# EAGLE design PowerPins (EAGLE 6.2)
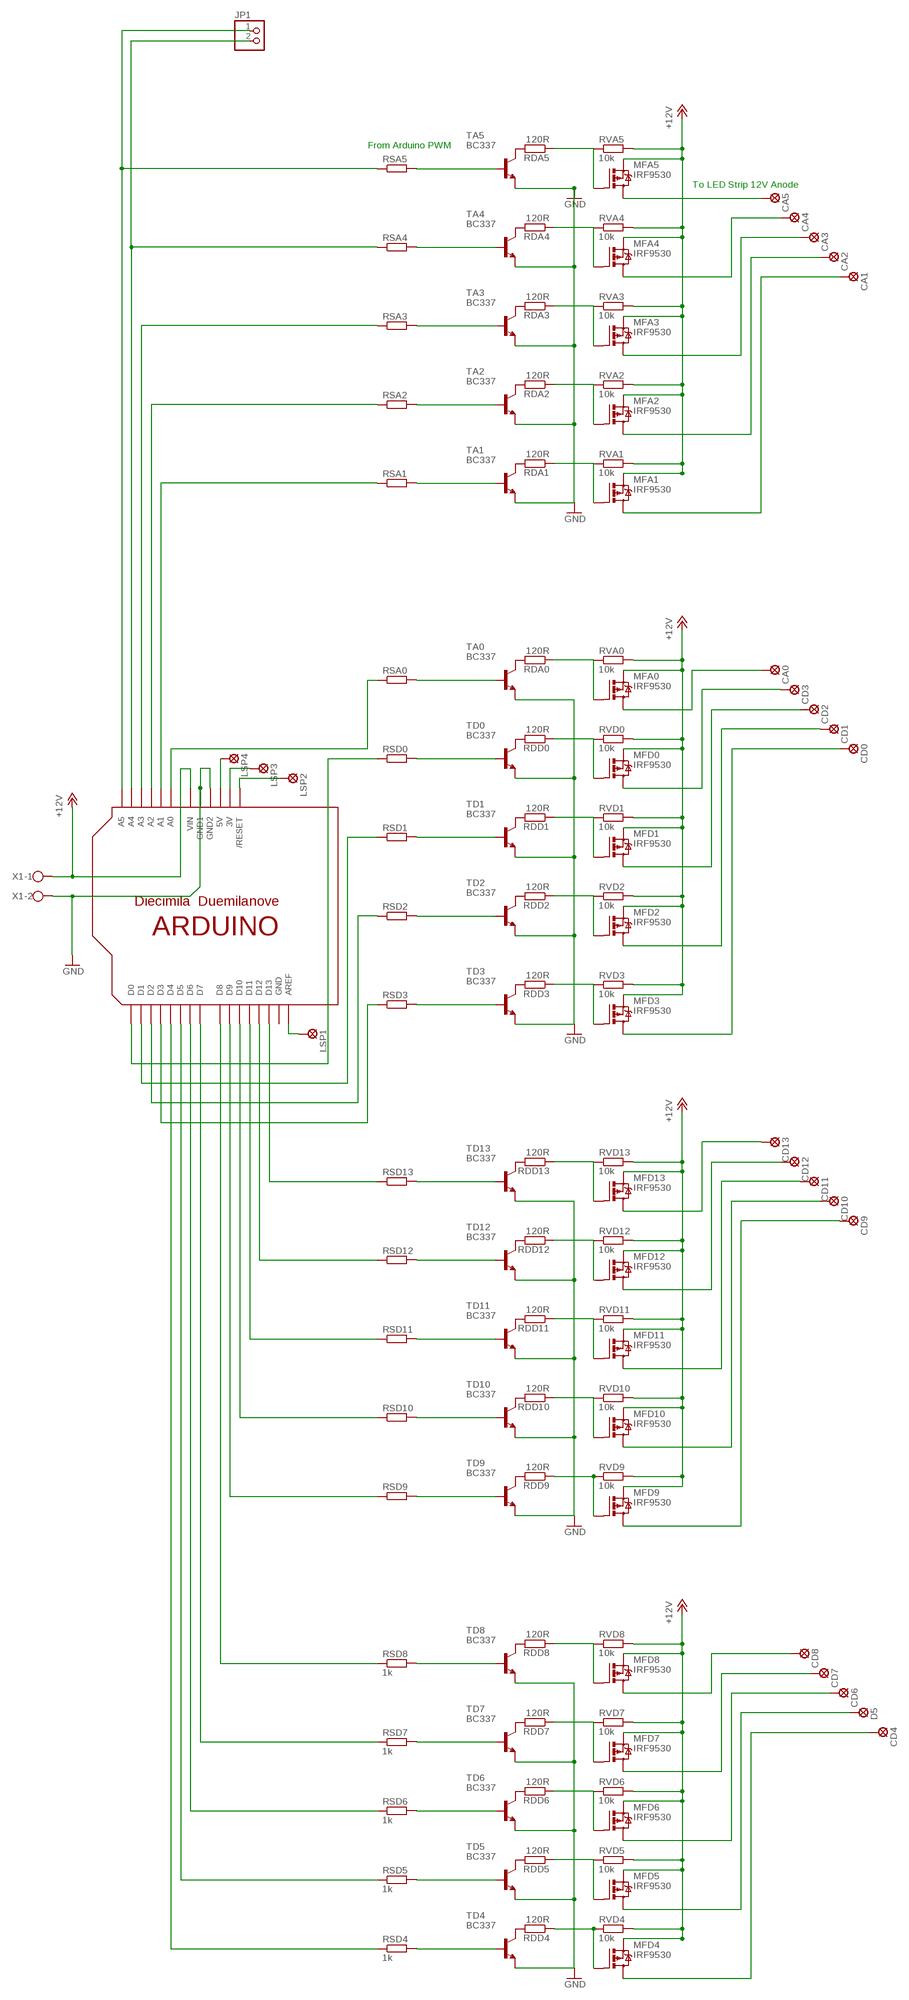
[diagram p0: schematic, sheet 1]

## Parts
CA0  SE14  [SE14]
CA1  SE14  [SE14]
CA2  SE14  [SE14]
CA3  SE14  [SE14]
CA4  SE14  [SE14]
CA5  SE14  [SE14]
CD0  SE14  [SE14]
CD1  SE14  [SE14]
CD2  SE14  [SE14]
CD3  SE14  [SE14]
CD4  SE14  [SE14]
CD6  SE14  [SE14]
CD7  SE14  [SE14]
CD8  SE14  [SE14]
CD9  SE14  [SE14]
CD10  SE14  [SE14]
CD11  SE14  [SE14]
CD12  SE14  [SE14]
CD13  SE14  [SE14]
D5  SE14  [SE14]
JP1  PINHD-1X2  [1X02]
LSP1  MCS10B  [MCS10B]
LSP2  MCS10B  [MCS10B]
LSP3  MCS10B  [MCS10B]
LSP4  MCS10B  [MCS10B]
MFA0  IRF9530  [TO220BV]
MFA1  IRF9530  [TO220BV]
MFA2  IRF9530  [TO220BV]
MFA3  IRF9530  [TO220BV]
MFA4  IRF9530  [TO220BV]
MFA5  IRF9530  [TO220BV]
MFD0  IRF9530  [TO220BV]
MFD1  IRF9530  [TO220BV]
MFD2  IRF9530  [TO220BV]
MFD3  IRF9530  [TO220BV]
MFD4  IRF9530  [TO220BV]
MFD5  IRF9530  [TO220BV]
MFD6  IRF9530  [TO220BV]
MFD7  IRF9530  [TO220BV]
MFD8  IRF9530  [TO220BV]
MFD9  IRF9530  [TO220BV]
MFD10  IRF9530  [TO220BV]
MFD11  IRF9530  [TO220BV]
MFD12  IRF9530  [TO220BV]
MFD13  IRF9530  [TO220BV]
RDA0  120R  R-EU_0204/5  [0204/5]
RDA1  120R  R-EU_0204/5  [0204/5]
RDA2  120R  R-EU_0204/5  [0204/5]
RDA3  120R  R-EU_0204/5  [0204/5]
RDA4  120R  R-EU_0204/5  [0204/5]
RDA5  120R  R-EU_0204/5  [0204/5]
RDD0  120R  R-EU_0204/5  [0204/5]
RDD1  120R  R-EU_0204/5  [0204/5]
RDD2  120R  R-EU_0204/5  [0204/5]
RDD3  120R  R-EU_0204/5  [0204/5]
RDD4  120R  R-EU_0204/5  [0204/5]
RDD5  120R  R-EU_0204/5  [0204/5]
RDD6  120R  R-EU_0204/5  [0204/5]
RDD7  120R  R-EU_0204/5  [0204/5]
RDD8  120R  R-EU_0204/5  [0204/5]
RDD9  120R  R-EU_0204/5  [0204/5]
RDD10  120R  R-EU_0204/5  [0204/5]
RDD11  120R  R-EU_0204/5  [0204/5]
RDD12  120R  R-EU_0204/5  [0204/5]
RDD13  120R  R-EU_0204/5  [0204/5]
RSA0  R-EU_0204/5  [0204/5]
RSA1  R-EU_0204/5  [0204/5]
RSA2  R-EU_0204/5  [0204/5]
RSA3  R-EU_0204/5  [0204/5]
RSA4  R-EU_0204/5  [0204/5]
RSA5  R-EU_0204/5  [0204/5]
RSD0  R-EU_0204/5  [0204/5]
RSD1  R-EU_0204/5  [0204/5]
RSD2  R-EU_0204/5  [0204/5]
RSD3  R-EU_0204/5  [0204/5]
RSD4  1k  R-EU_0204/5  [0204/5]
RSD5  1k  R-EU_0204/5  [0204/5]
RSD6  1k  R-EU_0204/5  [0204/5]
RSD7  1k  R-EU_0204/5  [0204/5]
RSD8  1k  R-EU_0204/5  [0204/5]
RSD9  R-EU_0204/5  [0204/5]
RSD10  R-EU_0204/5  [0204/5]
RSD11  R-EU_0204/5  [0204/5]
RSD12  R-EU_0204/5  [0204/5]
RSD13  R-EU_0204/5  [0204/5]
RVA0  10k  R-EU_0204/5  [0204/5]
RVA1  10k  R-EU_0204/5  [0204/5]
RVA2  10k  R-EU_0204/5  [0204/5]
RVA3  10k  R-EU_0204/5  [0204/5]
RVA4  10k  R-EU_0204/5  [0204/5]
RVA5  10k  R-EU_0204/5  [0204/5]
RVD0  10k  R-EU_0204/5  [0204/5]
RVD1  10k  R-EU_0204/5  [0204/5]
RVD2  10k  R-EU_0204/5  [0204/5]
RVD3  10k  R-EU_0204/5  [0204/5]
RVD4  10k  R-EU_0204/5  [0204/5]
RVD5  10k  R-EU_0204/5  [0204/5]
RVD6  10k  R-EU_0204/5  [0204/5]
RVD7  10k  R-EU_0204/5  [0204/5]
RVD8  10k  R-EU_0204/5  [0204/5]
RVD9  10k  R-EU_0204/5  [0204/5]
RVD10  10k  R-EU_0204/5  [0204/5]
RVD11  10k  R-EU_0204/5  [0204/5]
RVD12  10k  R-EU_0204/5  [0204/5]
RVD13  10k  R-EU_0204/5  [0204/5]
TA0  BC337  [TO92]
TA1  BC337  [TO92]
TA2  BC337  [TO92]
TA3  BC337  [TO92]
TA4  BC337  [TO92]
TA5  BC337  [TO92]
TD0  BC337  [TO92]
TD1  BC337  [TO92]
TD2  BC337  [TO92]
TD3  BC337  [TO92]
TD4  BC337  [TO92]
TD5  BC337  [TO92]
TD6  BC337  [TO92]
TD7  BC337  [TO92]
TD8  BC337  [TO92]
TD9  BC337  [TO92]
TD10  BC337  [TO92]
TD11  BC337  [TO92]
TD12  BC337  [TO92]
TD13  BC337  [TO92]
U$1  ARDUINOUNO  [ARDUINO]
X1  W237-102  [W237-102]

## Nets
+12V: MFA0.S MFA1.S MFA2.S MFA3.S MFA4.S MFA5.S MFD0.S MFD1.S MFD2.S MFD3.S MFD4.S MFD5.S MFD6.S MFD7.S MFD8.S MFD9.S MFD10.S MFD11.S MFD12.S MFD13.S RVA0.2 RVA1.2 RVA2.2 RVA3.2 RVA4.2 RVA5.2 RVD0.2 RVD1.2 RVD2.2 RVD3.2 RVD4.2 RVD5.2 RVD6.2 RVD7.2 RVD8.2 RVD9.2 RVD10.2 RVD11.2 RVD12.2 RVD13.2 U$1.VIN X1.1
C9V: RSA0.1 U$1.A0
CD12: CD11.MP MFD11.D
CD13: CD12.MP MFD12.D
GND: TA0.1(E) TA1.1(E) TA2.1(E) TA3.1(E) TA4.1(E) TA5.1(E) TD0.1(E) TD1.1(E) TD2.1(E) TD3.1(E) TD4.1(E) TD5.1(E) TD6.1(E) TD7.1(E) TD8.1(E) TD9.1(E) TD10.1(E) TD11.1(E) TD12.1(E) TD13.1(E) U$1.GND1 U$1.GND2 X1.2
MFD9: CD9.MP MFD9.D
MFDA3: CA3.MP MFA3.D
N$1: RDA5.2 TA5.3(C)
N$2: RSA5.2 TA5.2(B)
N$3: MFA5.G RDA5.1 RVA5.1
N$4: RDA4.2 TA4.3(C)
N$5: RSA4.2 TA4.2(B)
N$6: RDA0.2 TA0.3(C)
N$7: RSA0.2 TA0.2(B)
N$8: MFA0.G RDA0.1 RVA0.1
N$9: RDD0.2 TD0.3(C)
N$10: RSD0.2 TD0.2(B)
N$11: RDD10.2 TD10.3(C)
N$12: RSD10.2 TD10.2(B)
N$13: MFD10.G RDD10.1 RVD10.1
N$14: RDA1.2 TA1.3(C)
N$15: CA5.MP MFA5.D
N$16: RDD8.2 TD8.3(C)
N$17: RSD8.2 TD8.2(B)
N$18: MFD8.G RDD8.1 RVD8.1
N$19: RDD7.2 TD7.3(C)
N$20: RDD4.2 TD4.3(C)
N$21: LSP4.MP U$1.5V
N$22: RSA1.1 U$1.A1
N$23: RSA2.1 U$1.A2
N$24: RSA3.1 U$1.A3
N$25: JP1.2 RSA4.1 U$1.A4
N$26: JP1.1 RSA5.1 U$1.A5
N$27: CA4.MP MFA4.D
N$28: RSD13.1 U$1.D13
N$29: RSD12.1 U$1.D12
N$30: RSD11.1 U$1.D11
N$31: CA2.MP MFA2.D
N$32: RSD10.1 U$1.D10
N$33: RSD9.1 U$1.D9
N$34: RSD8.1 U$1.D8
N$35: RSD7.1 U$1.D7
N$36: CA1.MP MFA1.D
N$37: RSD6.1 U$1.D6
N$38: CA0.MP MFA0.D
N$39: CD3.MP MFD0.D
N$40: RSD5.1 U$1.D5
N$41: CD2.MP MFD1.D
N$42: CD1.MP MFD2.D
N$43: CD0.MP MFD3.D
N$44: CD13.MP MFD13.D
N$45: RSA1.2 TA1.2(B)
N$46: MFA1.G RDA1.1 RVA1.1
N$47: CD10.MP MFD10.D
N$48: RDD11.2 TD11.3(C)
N$49: CD8.MP MFD8.D
N$50: CD7.MP MFD7.D
N$51: CD6.MP MFD6.D
N$52: LSP3.MP U$1.3V
N$53: D5.MP MFD5.D
N$54: CD4.MP MFD4.D
N$55: RSD4.1 U$1.D4
N$56: RSD3.1 U$1.D3
N$57: RSD2.1 U$1.D2
N$58: LSP2.MP U$1.RESET(/RESET)
N$59: LSP1.MP U$1.AREF
N$60: RSD4.2 TD4.2(B)
N$61: RDD9.2 TD9.3(C)
N$64: RSD11.2 TD11.2(B)
N$66: MFD9.G RDD9.1 RVD9.1
N$67: MFD4.G RDD4.1 RVD4.1
N$68: MFD11.G RDD11.1 RVD11.1
N$69: RDD12.2 TD12.3(C)
N$70: RSD12.2 TD12.2(B)
N$71: MFD12.G RDD12.1 RVD12.1
N$72: RDD13.2 TD13.3(C)
N$73: RSD13.2 TD13.2(B)
N$74: MFD13.G RDD13.1 RVD13.1
N$75: RSD7.2 TD7.2(B)
N$76: MFD7.G RDD7.1 RVD7.1
N$77: RDD6.2 TD6.3(C)
N$78: RSD6.2 TD6.2(B)
N$79: MFD6.G RDD6.1 RVD6.1
N$80: RDD5.2 TD5.3(C)
N$81: RSD5.2 TD5.2(B)
N$82: MFD5.G RDD5.1 RVD5.1
N$83: MFD0.G RDD0.1 RVD0.1
N$84: RDD1.2 TD1.3(C)
N$85: RSD1.2 TD1.2(B)
N$86: MFD1.G RDD1.1 RVD1.1
N$87: RDD2.2 TD2.3(C)
N$88: RSD2.2 TD2.2(B)
N$89: MFD2.G RDD2.1 RVD2.1
N$90: RDD3.2 TD3.3(C)
N$91: RSD3.2 TD3.2(B)
N$92: MFD3.G RDD3.1 RVD3.1
N$93: MFA4.G RDA4.1 RVA4.1
N$94: RDA3.2 TA3.3(C)
N$95: RSA3.2 TA3.2(B)
N$96: MFA3.G RDA3.1 RVA3.1
N$97: RDA2.2 TA2.3(C)
N$98: RSA2.2 TA2.2(B)
N$99: MFA2.G RDA2.1 RVA2.1
OUT0: RSD0.1 U$1.D0
OUT1: RSD1.1 U$1.D1
TD9: RSD9.2 TD9.2(B)

## Notes on the sheet
- From Arduino PWM
- To LED Strip 12V Anode

## Power pins joined to a net without a drawn wire
GND: U$1.GND

## Library data of the parts
CA0 CA1-CA5 CD0 CD1-CD4 CD6-CD13 D5 = solpad:SE14: SOLDER PAD E1553, drill 1,4mm, distributor Buerklin, 07F820
JP1 = pinhead:PINHD-1X2: PIN HEADER
LSP1-LSP4 = solpad:MCS10B: SOLDER PAD MC S1, distributor Buerklin, 15F505
MFA0 MFA1-MFA5 MFD0 MFD1-MFD13 = transistor-power:IRF9530: P-CHANNEL HEXFET POWER-MOS-FET Source: http://www.irf.com/product-info/datasheets/data/irf9530.pdf
RDA0 RDD0 RDD1-RDD9 RDD13 RSD9 RSD13 RVA0 RVD0 RVD1-RVD9 RVD13 = rcl:R-EU_: RESISTOR, European symbol
RDA1-RDA5 RDD10-RDD12 RSA0 RSA1-RSA5 RSD0 RSD1-RSD8 RSD10-RSD12 RVA1-RVA5 RVD10-RVD12 = resistor:R-EU_: RESISTOR, European symbol
TA0 TA1-TA5 TD0 TD1-TD13 = transistor:BC337: NPN TRANSISTOR
U$1 = adafruit:ARDUINO: Arduino Diecimila/Duemilanove Make a shield with ease, this package has all the named pins as well as the two mounting drill holes and an outline of the USB and DC power connector. The outline is on the DIMENSION layer, so if your board house uses it they will cut the outline to match. http://www.ladyada.net/library/pcb/eaglelibrary.html
X1 = con-wago-500:W237-102: WAGO SCREW CLAMP; MPN: 237-102; OC_FARNELL: unknown; OC_NEWARK: 70K9898

## Board
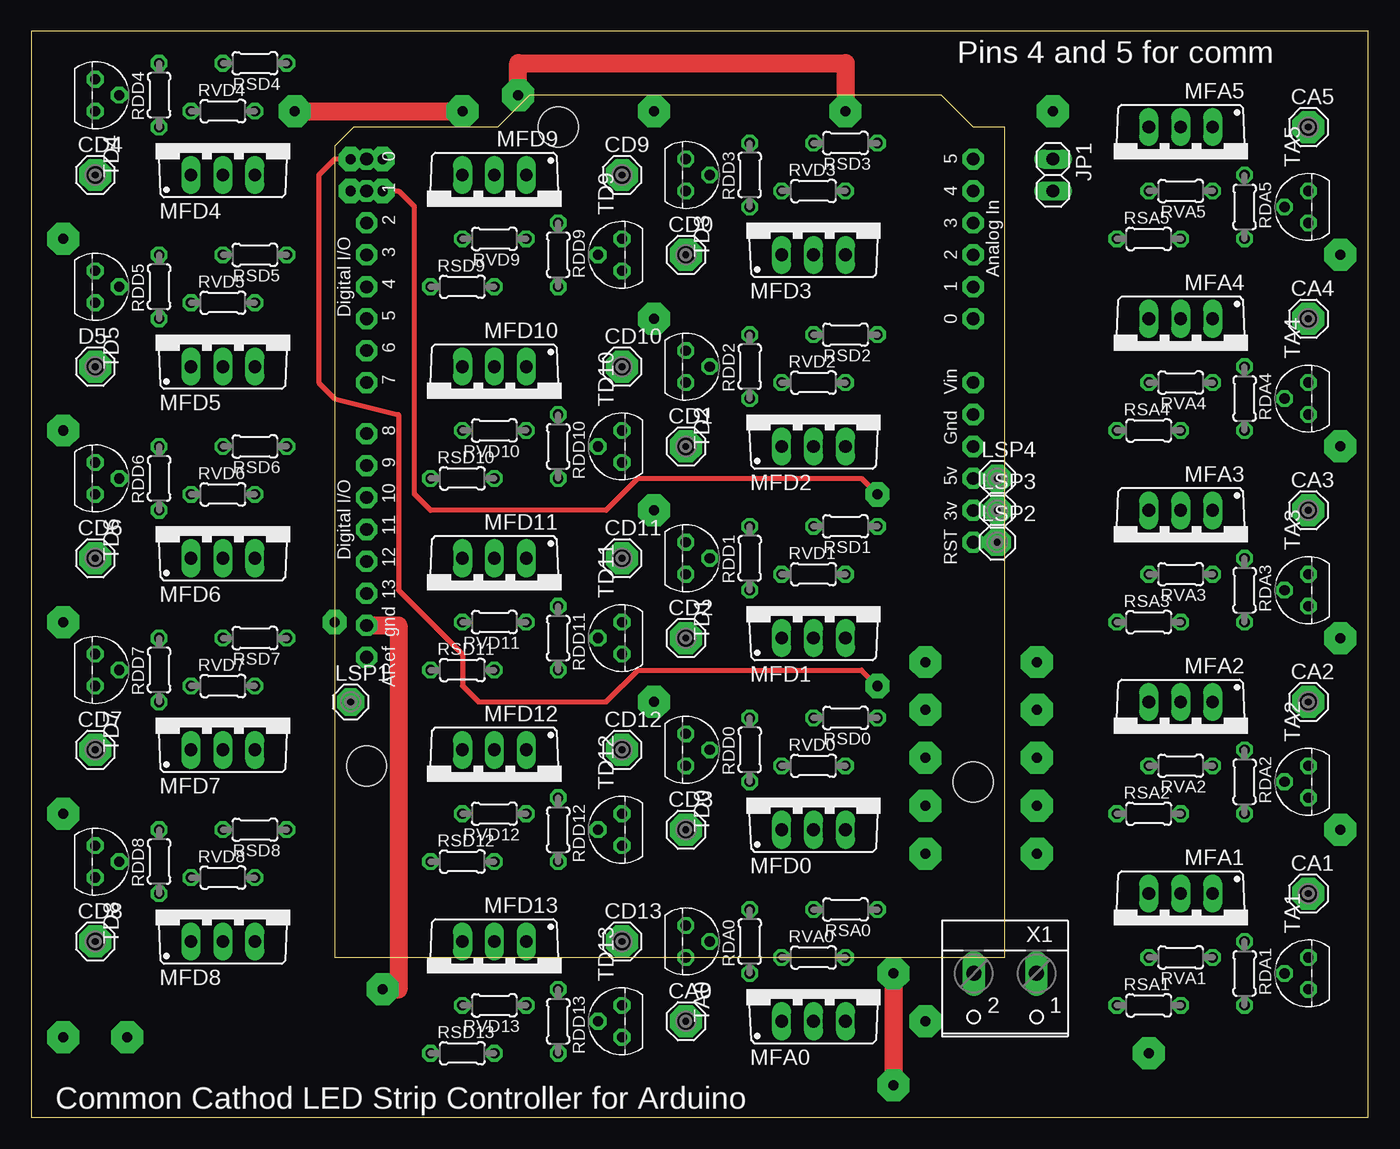
[diagram p1: board, top side]
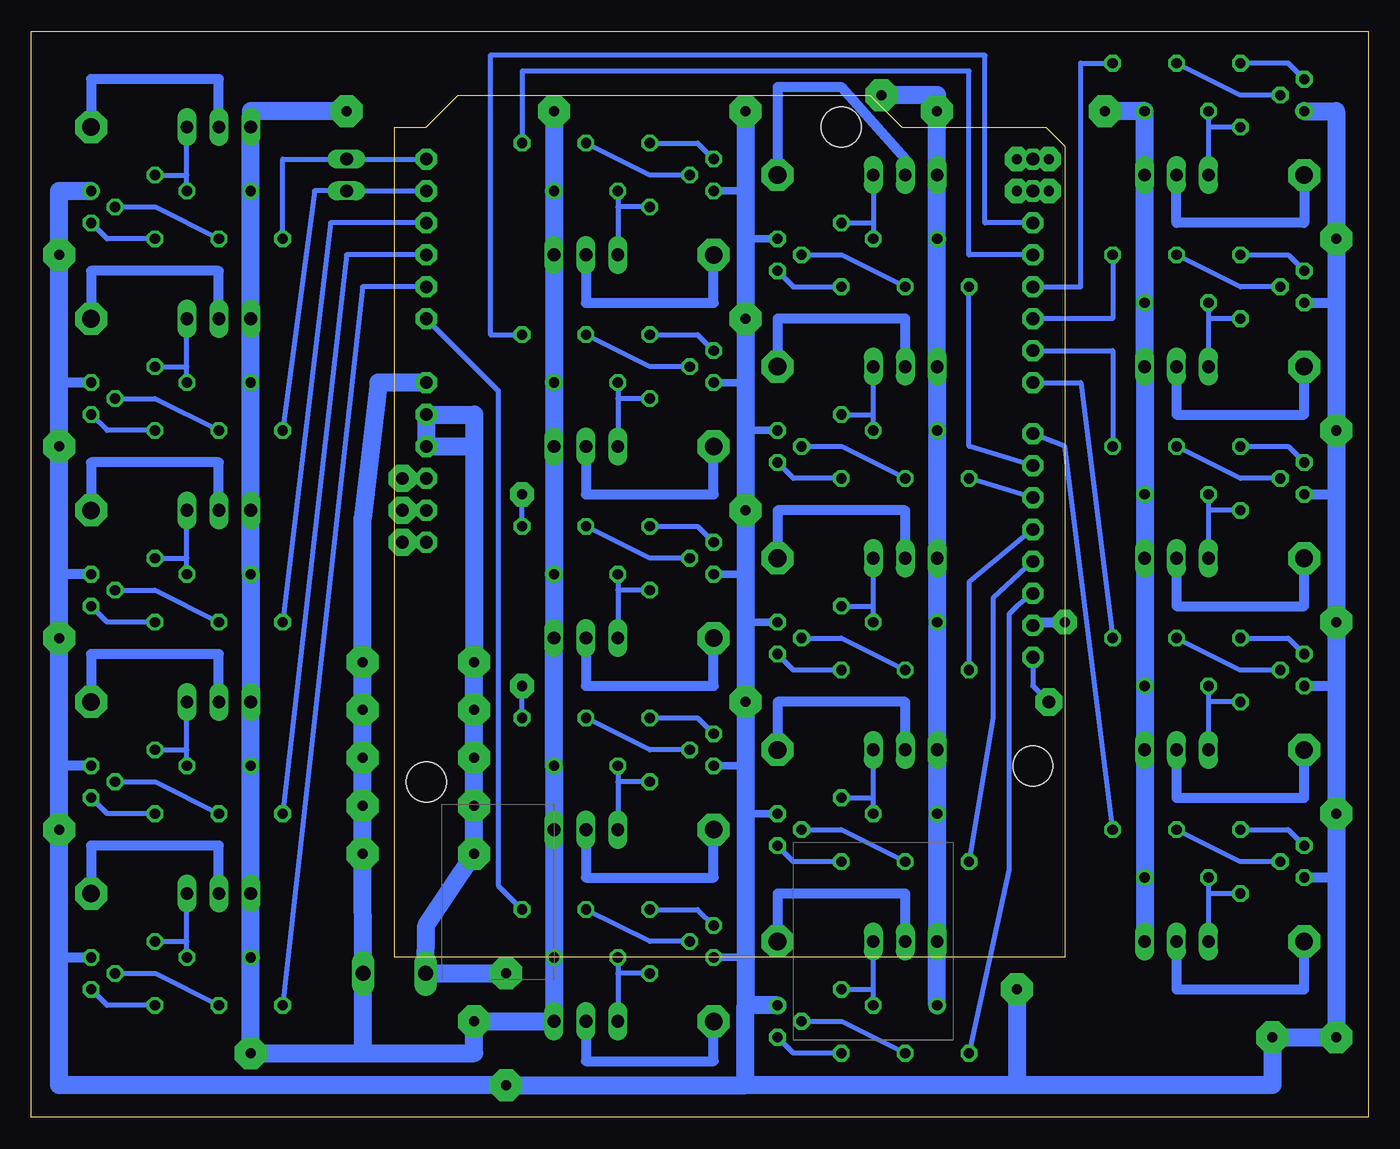
[diagram p2: board, bottom side, seen from below]

Size 106.35 x 86.35 mm. Coordinates in mm from the lower left corner, seen from the top.
Outline: 0,0 106.35,0 106.35,86.35 0,86.35 0,0
Copper layers (1*16): Top 0.035mm / dielectric 1.5mm / Bottom 0.035mm
Design rules: minimum track width 10mil, minimum drill 24mil, track to track 8mil, track to pad 8mil, pad to pad 8mil, via to via 8mil, smd to smd 8mil, copper to edge 0mil, drill to drill 8mil, minimum pad ring 10mil, minimum via ring 8mil, stop-mask expansion 4mil, vias tented up to drill 0mil, thermal gap 10mil

### Footprints (pad centres in the part's own frame; a part is rotated, then mirrored left to right if it is on the bottom)
SE14 = drill 1.397 pad 2.54 octagon: MP 0,0
1X02 = drill 1.016 long: 1 -1.27,0; 2 1.27,0
MCS10B = drill 1.016 pad 2.159 octagon: MP 0,0
TO220BV = drill 1.016 long: D 0,-2.54; G -2.54,-2.54; S 2.54,-2.54
0204/5 = drill 0.813 octagon: 1 -2.54,0; 2 2.54,0
TO92 = drill 0.813 octagon: 1 1.27,0; 2 0,1.905; 3 -1.27,0
ARDUINO = drill 1 pad 1.676 octagon: 3V 35.56,2.54; 5V 38.1,2.54; A0 50.8,2.54; A1 53.34,2.54; A2 55.88,2.54; A3 58.42,2.54; A4 60.96,2.54; A5 63.5,2.54; AREF 23.876,50.8; D0 63.5,50.8; D1 60.96,50.8; D2 58.42,50.8; D3 55.88,50.8; D4 53.34,50.8; D5 50.8,50.8; D6 48.26,50.8; D7 45.72,50.8; D8 41.656,50.8; D9 39.116,50.8; D10 36.576,50.8; D11 34.036,50.8; D12 31.496,50.8; D13 28.956,50.8; GND 26.416,50.8; GND1 43.18,2.54; GND2 40.64,2.54; RESET 33.02,2.54; VIN 45.72,2.54 | hole 3.2: 15.24,50.8; 66.04,35.56; 13.97,2.54
W237-102 = drill 1.194 long: 1 -2.5,-1.27; 2 2.5,-1.27

### Placement (x,y rotation side)
CA0  52.07,7.62 0 top
CA1  101.6,17.78 0 top
CA2  101.6,33.02 0 top
CA3  101.6,48.26 0 top
CA4  101.6,63.5 0 top
CA5  101.6,78.74 0 top
CD0  52.07,68.58 0 top
CD1  52.07,53.34 0 top
CD2  52.07,38.1 0 top
CD3  52.07,22.86 0 top
CD4  5.08,74.93 0 top
CD6  5.08,44.45 0 top
CD7  5.08,29.21 0 top
CD8  5.08,13.97 0 top
CD9  46.99,74.93 0 top
CD10  46.99,59.69 0 top
CD11  46.99,44.45 0 top
CD12  46.99,29.21 0 top
CD13  46.99,13.97 0 top
D5  5.08,59.69 0 top
JP1  81.28,74.93 270 top
LSP1  25.4,33.02 0 top
LSP2  76.83,45.72 0 top
LSP3  76.83,48.26 0 top
LSP4  76.83,50.8 0 top
MFA0  62.23,10.16 0 top
MFA1  91.44,15.24 180 top
MFA2  91.44,30.48 180 top
MFA3  91.44,45.72 180 top
MFA4  91.44,60.96 180 top
MFA5  91.44,76.2 180 top
MFD0  62.23,25.4 0 top
MFD1  62.23,40.64 0 top
MFD2  62.23,55.88 0 top
MFD3  62.23,71.12 0 top
MFD4  15.24,77.47 0 top
MFD5  15.24,62.23 0 top
MFD6  15.24,46.99 0 top
MFD7  15.24,31.75 0 top
MFD8  15.24,16.51 0 top
MFD9  36.83,72.39 180 top
MFD10  36.83,57.15 180 top
MFD11  36.83,41.91 180 top
MFD12  36.83,26.67 180 top
MFD13  36.83,11.43 180 top
RDA0  57.15,13.97 90 top
RDA1  96.52,11.43 270 top
RDA2  96.52,26.67 270 top
RDA3  96.52,41.91 270 top
RDA4  96.52,57.15 270 top
RDA5  96.52,72.39 270 top
RDD0  57.15,29.21 90 top
RDD1  57.15,44.45 90 top
RDD2  57.15,59.69 90 top
RDD3  57.15,74.93 90 top
RDD4  10.16,81.28 90 top
RDD5  10.16,66.04 90 top
RDD6  10.16,50.8 90 top
RDD7  10.16,35.56 90 top
RDD8  10.16,20.32 90 top
RDD9  41.91,68.58 270 top
RDD10  41.91,53.34 270 top
RDD11  41.91,38.1 270 top
RDD12  41.91,22.86 270 top
RDD13  41.91,7.62 270 top
RSA0  64.77,16.51 180 top
RSA1  88.9,8.89 0 top
RSA2  88.9,24.13 0 top
RSA3  88.9,39.37 0 top
RSA4  88.9,54.61 0 top
RSA5  88.9,69.85 0 top
RSD0  64.77,31.75 180 top
RSD1  64.77,46.99 180 top
RSD2  64.77,62.23 180 top
RSD3  64.77,77.47 180 top
RSD4  17.78,83.82 180 top
RSD5  17.78,68.58 180 top
RSD6  17.78,53.34 180 top
RSD7  17.78,38.1 180 top
RSD8  17.78,22.86 180 top
RSD9  34.29,66.04 0 top
RSD10  34.29,50.8 0 top
RSD11  34.29,35.56 0 top
RSD12  34.29,20.32 0 top
RSD13  34.29,5.08 0 top
RVA0  62.23,12.7 0 top
RVA1  91.44,12.7 180 top
RVA2  91.44,27.94 180 top
RVA3  91.44,43.18 180 top
RVA4  91.44,58.42 180 top
RVA5  91.44,73.66 180 top
RVD0  62.23,27.94 0 top
RVD1  62.23,43.18 0 top
RVD2  62.23,58.42 0 top
RVD3  62.23,73.66 0 top
RVD4  15.24,80.01 0 top
RVD5  15.24,64.77 0 top
RVD6  15.24,49.53 0 top
RVD7  15.24,34.29 0 top
RVD8  15.24,19.05 0 top
RVD9  36.83,69.85 180 top
RVD10  36.83,54.61 180 top
RVD11  36.83,39.37 180 top
RVD12  36.83,24.13 180 top
RVD13  36.83,8.89 180 top
TA0  52.07,13.97 270 top
TA1  101.6,11.43 90 top
TA2  101.6,26.67 90 top
TA3  101.6,41.91 90 top
TA4  101.6,57.15 90 top
TA5  101.6,72.39 90 top
TD0  52.07,29.21 270 top
TD1  52.07,44.45 270 top
TD2  52.07,59.69 270 top
TD3  52.07,74.93 270 top
TD4  5.08,81.28 270 top
TD5  5.08,66.04 270 top
TD6  5.08,50.8 270 top
TD7  5.08,35.56 270 top
TD8  5.08,20.32 270 top
TD9  46.99,68.58 90 top
TD10  46.99,53.34 90 top
TD11  46.99,38.1 90 top
TD12  46.99,22.86 90 top
TD13  46.99,7.62 90 top
U$1  77.47,12.7 90 top
X1  77.47,10.16 180 top

### Tracks (layer width: path | path; a pad name or v marks a point on that pad's centre or on a via)
+12V  (via drill 0.8 pad 2.54)
  Top 1.422: v38.73,81.28 38.73,83.82 64.77,83.82 v64.77,80.01 | v20.95,80.01 v34.29,80.01
  Bottom 0.406: MFD6.S RVD6.2 | RVD7.2 MFD7.S | RVD9.2 RVD10.2 | RVD8.2 MFD8.S | RVA2.2 MFA2.S | RVA3.2 MFA3.S | RVA4.2 MFA4.S | RVA5.2 MFA5.S | RVD0.2 MFD0.S | RVA0.2 MFA0.S
  Bottom 1.422: MFD8.S MFD7.S MFD6.S MFD5.S RVD5.2 MFD4.S RVD4.2 v20.95,80.01 | U$1.VIN 78.74,58.42 80.01,47.62 v80.01,36.2 v80.01,32.38 v80.01,28.57 v80.01,24.77 v80.01,20.95 X1.1 80.01,11.43 80.01,5.08 | RVD13.2 MFD13.S RVD12.2 MFD12.S RVD11.2 MFD11.S RVD10.2 MFD10.S RVD9.2 MFD9.S v34.29,80.01 34.29,81.28 v38.73,81.28 | v81.28,80.01 88.9,80.01 MFA5.S MFA4.S RVA3.2 MFA2.S MFA1.S RVA1.2 v88.9,5.08 80.01,5.08 | 80.01,5.08 71.12,5.08 v71.12,7.62 MFA0.S RVD0.2 MFD1.S RVD1.2 MFD2.S RVD2.2 MFD3.S RVD3.2 v64.77,80.01
C9V
  Bottom 0.406: U$1.A0 69.22,57.78 69.22,18.41 RSA0.1
CD12
  Bottom 0.813: MFD11.D 36.83,48.26 46.99,48.26 CD11.MP
CD13
  Bottom 0.813: MFD12.D 36.83,33.02 46.99,33.02 CD12.MP
GND  (via drill 0.8 pad 1.93, 0.8 pad 2.54)
  Top 1.422: v68.58,11.43 v68.58,2.54 | U$1.GND 29.21,39.12 29.21,10.16 v27.94,10.16
  Bottom 0.406: U$1.GND 26.67,39.37
  Bottom 0.61: TD3.1 49.53,73.66 49.53,69.85 | 49.53,69.85 v49.53,63.5 49.53,58.42 | 49.53,58.42 49.53,54.61 | 49.53,54.61 v49.53,48.26 49.53,43.18 | 49.53,43.18 49.53,39.37 | 49.53,39.37 v49.53,33.02 49.53,27.94 | 49.53,27.94 49.53,24.13 | 49.53,24.13 49.53,17.78 49.53,12.7 | 49.53,12.7 49.53,8.89 | TA0.1 49.53,12.7 | TD12.1 49.53,24.13 | TD0.1 49.53,27.94 | TD11.1 49.53,39.37 | TD1.1 49.53,43.18 | TD10.1 49.53,54.61 | TD2.1 49.53,58.42 | TD9.1 49.53,69.85
  Bottom 0.813: v2.54,69.85 2.54,64.77 | 2.54,64.77 v2.54,54.61 2.54,49.53 | 2.54,49.53 v2.54,39.37 2.54,34.29 | 2.54,34.29 v2.54,24.13 2.54,19.05 | 2.54,19.05 TD8.1 | TD5.1 2.54,64.77 | TD6.1 2.54,49.53 | TD7.1 2.54,34.29 | v104.14,68.58 104.14,58.42 | 104.14,58.42 v104.14,53.34 104.14,43.18 | 104.14,43.18 v104.14,38.1 104.14,27.94 | 104.14,27.94 v104.14,22.86 | 104.14,12.7 TA1.1 | TA2.1 104.14,27.94 | TA3.1 104.14,43.18 | TA4.1 104.14,58.42 | 2.54,19.05 v2.54,6.35 | v49.53,80.01 49.53,73.66 v49.53,63.5 | 26.67,39.37 v24.13,39.37
  Bottom 1.422: 71.12,53.34 71.12,55.88 U$1.GND1 U$1.GND2 71.12,53.34 | 71.12,53.34 v71.12,36.2 v71.12,32.38 v71.12,28.57 v71.12,24.77 v71.12,20.95 74.93,15.24 X1.2 v68.58,11.43 | TD4.1 2.54,80.01 v2.54,69.85 v2.54,54.61 v2.54,39.37 v2.54,24.13 v2.54,6.35 v7.62,6.35 7.62,2.54 27.94,2.54 | TA5.1 104.14,73.66 v104.14,68.58 v104.14,53.34 v104.14,38.1 v104.14,22.86 104.14,12.7 104.14,2.54 v68.58,2.54 49.53,2.54 | v49.53,80.01 v49.53,63.5 v49.53,48.26 v49.53,33.02 49.53,17.78 49.53,8.89 | TD13.1 49.53,8.89 | 27.94,2.54 49.53,2.54 | 49.53,2.54 49.53,8.89 | v27.94,10.16 27.94,2.54
MFD9
  Bottom 0.813: MFD9.D 36.83,76.2 41.91,81.92 46.99,81.92 CD9.MP
MFDA3
  Bottom 0.813: MFA3.D 91.44,52.07 101.6,52.07 CA3.MP
N$1
  Bottom 0.406: RDA5.2 100.33,69.85 TA5.3
N$2
  Bottom 0.406: TA5.2 96.52,72.39 RSA5.2
N$3
  Bottom 0.406: RVA5.1 93.98,74.93 | 93.98,74.93 MFA5.G | RDA5.1 93.98,74.93
N$4
  Bottom 0.406: RDA4.2 100.33,54.61 TA4.3
N$5
  Bottom 0.406: TA4.2 96.52,57.15 RSA4.2
N$6
  Bottom 0.406: RDA0.2 53.34,16.51 TA0.3
N$7
  Bottom 0.406: TA0.2 57.15,13.97 RSA0.2
N$8
  Bottom 0.406: RVA0.1 59.69,11.43 | 59.69,11.43 MFA0.G | RDA0.1 59.69,11.43
N$9
  Bottom 0.406: RDD0.2 53.34,31.75 TD0.3
N$10
  Bottom 0.406: TD0.2 57.15,29.21 RSD0.2
N$11
  Bottom 0.406: RDD10.2 45.72,50.8 TD10.3
N$12
  Bottom 0.406: TD10.2 41.91,53.34 RSD10.2
N$13
  Bottom 0.406: RVD10.1 39.37,55.88 | 39.37,55.88 MFD10.G | RDD10.1 39.37,55.88
N$14
  Bottom 0.406: RDA1.2 100.33,8.89 TA1.3
N$15
  Bottom 0.813: MFA5.D 91.44,82.55 101.6,82.55 CA5.MP
N$16
  Bottom 0.406: RDD8.2 6.35,22.86 TD8.3
N$17
  Bottom 0.406: TD8.2 10.16,20.32 RSD8.2
N$18
  Bottom 0.406: RVD8.1 12.7,17.78 | 12.7,17.78 MFD8.G | RDD8.1 12.7,17.78
N$19
  Bottom 0.406: RDD7.2 6.35,38.1 TD7.3
N$20
  Bottom 0.406: TD4.3 6.35,83.82 RDD4.2
N$21
  Bottom 0.406: U$1.5V LSP4.MP
N$22
  Bottom 0.406: U$1.A1 80.01,66.04 RSA1.1
N$23
  Bottom 0.406: U$1.A2 81.28,68.58 RSA2.1
N$24
  Bottom 0.406: U$1.A3 82.55,71.12 RSA3.1
N$25
  Bottom 0.406: U$1.A4 JP1.2 83.82,73.66 RSA4.1
N$26
  Bottom 0.406: U$1.A5 JP1.1 86.36,76.2 RSA5.1
N$27
  Bottom 0.813: MFA4.D 91.44,67.31 101.6,67.31 CA4.MP
N$28
  Bottom 0.406: U$1.D13 27.94,40.64 28.57,40.01 28.57,19.68 RSD13.1
N$29
  Bottom 0.406: U$1.D12 29.84,41.27 29.84,31.75 RSD12.1
N$30
  Bottom 0.406: U$1.D11 31.75,42.55 RSD11.1
N$31
  Bottom 0.813: MFA2.D 91.44,36.83 101.6,36.83 CA2.MP
N$32
  Bottom 0.406: U$1.D10 RSD10.1
N$33
  Bottom 0.406: U$1.D9 31.75,53.34 RSD9.1
N$34
  Bottom 0.406: RSD8.1 24.13,53.34 U$1.D8
N$35
  Bottom 0.406: U$1.D7 22.86,58.42 RSD7.1
N$36
  Bottom 0.813: MFA1.D 91.44,21.59 101.6,21.59 CA1.MP
N$37
  Bottom 0.406: U$1.D6 20.32,60.96 RSD6.1
N$38
  Bottom 0.813: MFA0.D 62.23,4.45 52.07,4.45 CA0.MP
N$39
  Bottom 0.813: MFD0.D 62.23,19.05 52.07,19.05 CD3.MP
N$40
  Bottom 0.406: RSD5.1 20.32,63.5 U$1.D5
N$41
  Bottom 0.813: MFD1.D 62.23,34.29 52.07,34.29 CD2.MP
N$42
  Bottom 0.813: MFD2.D 62.23,49.53 52.07,49.53 CD1.MP
N$43
  Bottom 0.813: MFD3.D 62.23,64.77 52.07,64.77 CD0.MP
N$44
  Bottom 0.813: MFD13.D 36.83,17.78 46.99,17.78 CD13.MP
N$45
  Bottom 0.406: TA1.2 96.52,11.43 RSA1.2
N$46
  Bottom 0.406: RVA1.1 93.98,13.97 | 93.98,13.97 MFA1.G | RDA1.1 93.98,13.97
N$47
  Bottom 0.813: MFD10.D 36.83,63.5 46.99,63.5 CD10.MP
N$48
  Bottom 0.406: RDD11.2 45.72,35.56 TD11.3
N$49
  Bottom 0.813: MFD8.D 15.24,10.16 5.08,10.16 CD8.MP
N$50
  Bottom 0.813: MFD7.D 15.24,25.4 5.08,25.4 CD7.MP
N$51
  Bottom 0.813: MFD6.D 15.24,40.64 5.08,40.64 CD6.MP
N$52
  Bottom 0.406: U$1.3V LSP3.MP
N$53
  Bottom 0.813: MFD5.D 15.24,55.88 5.08,55.88 D5.MP
N$54
  Bottom 0.813: CD4.MP 5.08,71.12 15.24,71.12 MFD4.D
N$55
  Bottom 0.406: U$1.D4 22.86,66.04 22.86,83.82 RSD4.1
N$56
  Bottom 0.406: U$1.D3 31.75,68.58 31.75,83.19 67.31,83.19 RSD3.1
N$57
  Bottom 0.406: U$1.D2 30.48,71.12 30.48,84.46 69.85,84.46 69.85,62.23 RSD2.1
N$58
  Bottom 0.406: U$1.RESET LSP2.MP
N$59
  Bottom 0.406: U$1.AREF 26.67,34.29 LSP1.MP
N$60
  Bottom 0.406: TD4.2 10.16,81.28 RSD4.2
N$61
  Bottom 0.406: TD9.3 45.72,66.04 RDD9.2
N$64
  Bottom 0.406: TD11.2 41.91,38.1 RSD11.2
N$66
  Bottom 0.406: MFD9.G 39.37,71.12 | 39.37,71.12 RVD9.1 | RDD9.1 39.37,71.12
N$67
  Bottom 0.406: RVD4.1 12.7,78.74 | 12.7,78.74 MFD4.G | RDD4.1 12.7,78.74
N$68
  Bottom 0.406: RVD11.1 39.37,40.64 | 39.37,40.64 MFD11.G | RDD11.1 39.37,40.64
N$69
  Bottom 0.406: RDD12.2 45.72,20.32 TD12.3
N$70
  Bottom 0.406: TD12.2 41.91,22.86 RSD12.2
N$71
  Bottom 0.406: RVD12.1 39.37,25.4 | 39.37,25.4 MFD12.G | RDD12.1 39.37,25.4
N$72
  Bottom 0.406: RDD13.2 45.72,5.08 TD13.3
N$73
  Bottom 0.406: TD13.2 41.91,7.62 RSD13.2
N$74
  Bottom 0.406: RVD13.1 39.37,10.16 | 39.37,10.16 MFD13.G | RDD13.1 39.37,10.16
N$75
  Bottom 0.406: TD7.2 10.16,35.56 RSD7.2
N$76
  Bottom 0.406: RVD7.1 12.7,33.02 | 12.7,33.02 MFD7.G | RDD7.1 12.7,33.02
N$77
  Bottom 0.406: RDD6.2 6.35,53.34 TD6.3
N$78
  Bottom 0.406: TD6.2 10.16,50.8 RSD6.2
N$79
  Bottom 0.406: RVD6.1 12.7,48.26 | 12.7,48.26 MFD6.G | RDD6.1 12.7,48.26
N$80
  Bottom 0.406: RDD5.2 6.35,68.58 TD5.3
N$81
  Bottom 0.406: TD5.2 10.16,66.04 RSD5.2
N$82
  Bottom 0.406: RVD5.1 12.7,63.5 | 12.7,63.5 MFD5.G | RDD5.1 12.7,63.5
N$83
  Bottom 0.406: RVD0.1 59.69,26.67 | 59.69,26.67 MFD0.G | RDD0.1 59.69,26.67
N$84
  Bottom 0.406: RDD1.2 53.34,46.99 TD1.3
N$85
  Bottom 0.406: TD1.2 57.15,44.45 RSD1.2
N$86
  Bottom 0.406: RVD1.1 59.69,41.91 | 59.69,41.91 MFD1.G | RDD1.1 59.69,41.91
N$87
  Bottom 0.406: RDD2.2 53.34,62.23 TD2.3
N$88
  Bottom 0.406: TD2.2 57.15,59.69 RSD2.2
N$89
  Bottom 0.406: RVD2.1 59.69,57.15 | 59.69,57.15 MFD2.G | RDD2.1 59.69,57.15
N$90
  Bottom 0.406: RDD3.2 53.34,77.47 TD3.3
N$91
  Bottom 0.406: TD3.2 57.15,74.93 RSD3.2
N$92
  Bottom 0.406: RVD3.1 59.69,72.39 | 59.69,72.39 MFD3.G | RDD3.1 59.69,72.39
N$93
  Bottom 0.406: RVA4.1 93.98,59.69 | 93.98,59.69 MFA4.G | RDA4.1 93.98,59.69
N$94
  Bottom 0.406: RDA3.2 100.33,39.37 TA3.3
N$95
  Bottom 0.406: TA3.2 96.52,41.91 RSA3.2
N$96
  Bottom 0.406: RVA3.1 93.98,44.45 | 93.98,44.45 MFA3.G | RDA3.1 93.98,44.45
N$97
  Bottom 0.406: RDA2.2 100.33,24.13 TA2.3
N$98
  Bottom 0.406: TA2.2 96.52,26.67 RSA2.2
N$99
  Bottom 0.406: RVA2.1 93.98,29.21 | 93.98,29.21 MFA2.G | RDA2.1 93.98,29.21
OUT0  (via drill 0.8 pad 1.93)
  Top 0.406: v25.4,76.2 24.13,76.2 22.86,74.93 22.86,58.42 24.13,57.15 29.21,55.88 29.21,41.91 34.29,36.83 34.29,34.29 35.56,33.02 45.72,33.02 48.26,35.56 66.04,35.56 v67.31,34.29
  Bottom 0.406: RSD0.1 v67.31,34.29 | v25.4,76.2 U$1.D0 v27.94,76.2
OUT1  (via drill 0.8 pad 1.93)
  Top 0.406: U$1.D1 29.21,73.66 30.48,72.39 30.48,49.53 31.75,48.26 45.72,48.26 48.26,50.8 66.04,50.8 v67.31,49.53
  Bottom 0.406: RSD1.1 v67.31,49.53 | v25.4,73.66 U$1.D1 v27.94,73.66
TD9
  Bottom 0.406: TD9.2 41.91,68.58 RSD9.2

### Text on the board
_tsilk: Pins 4 and 5 for comm | Common Cathod LED Strip Controller for Arduino